# Altium schematic sheet Output - 24V.SchDoc
size A
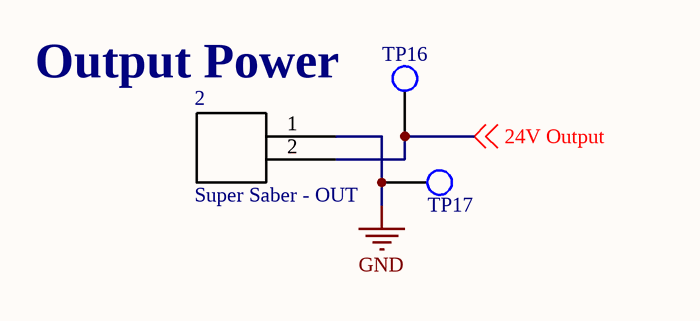
[diagram p0: Output - 24V.SchDoc]

## Parts
2  Super Saber - OUT  [0431600102]
TP16  Test Point  [Test Point Through-hole]  (value not drawn)
TP17  Test Point  [Test Point Through-hole]  (value not drawn)

## Nets
GND: 2.1 TP17.1
24V Output : 2.2 TP16.1 ; off-sheet 24V Output 

## Notes on the sheet
- Output Power

## Library data of the parts
2 = Super Saber